# Altium schematic sheet Pulser & AD8331.SchDoc
size A3
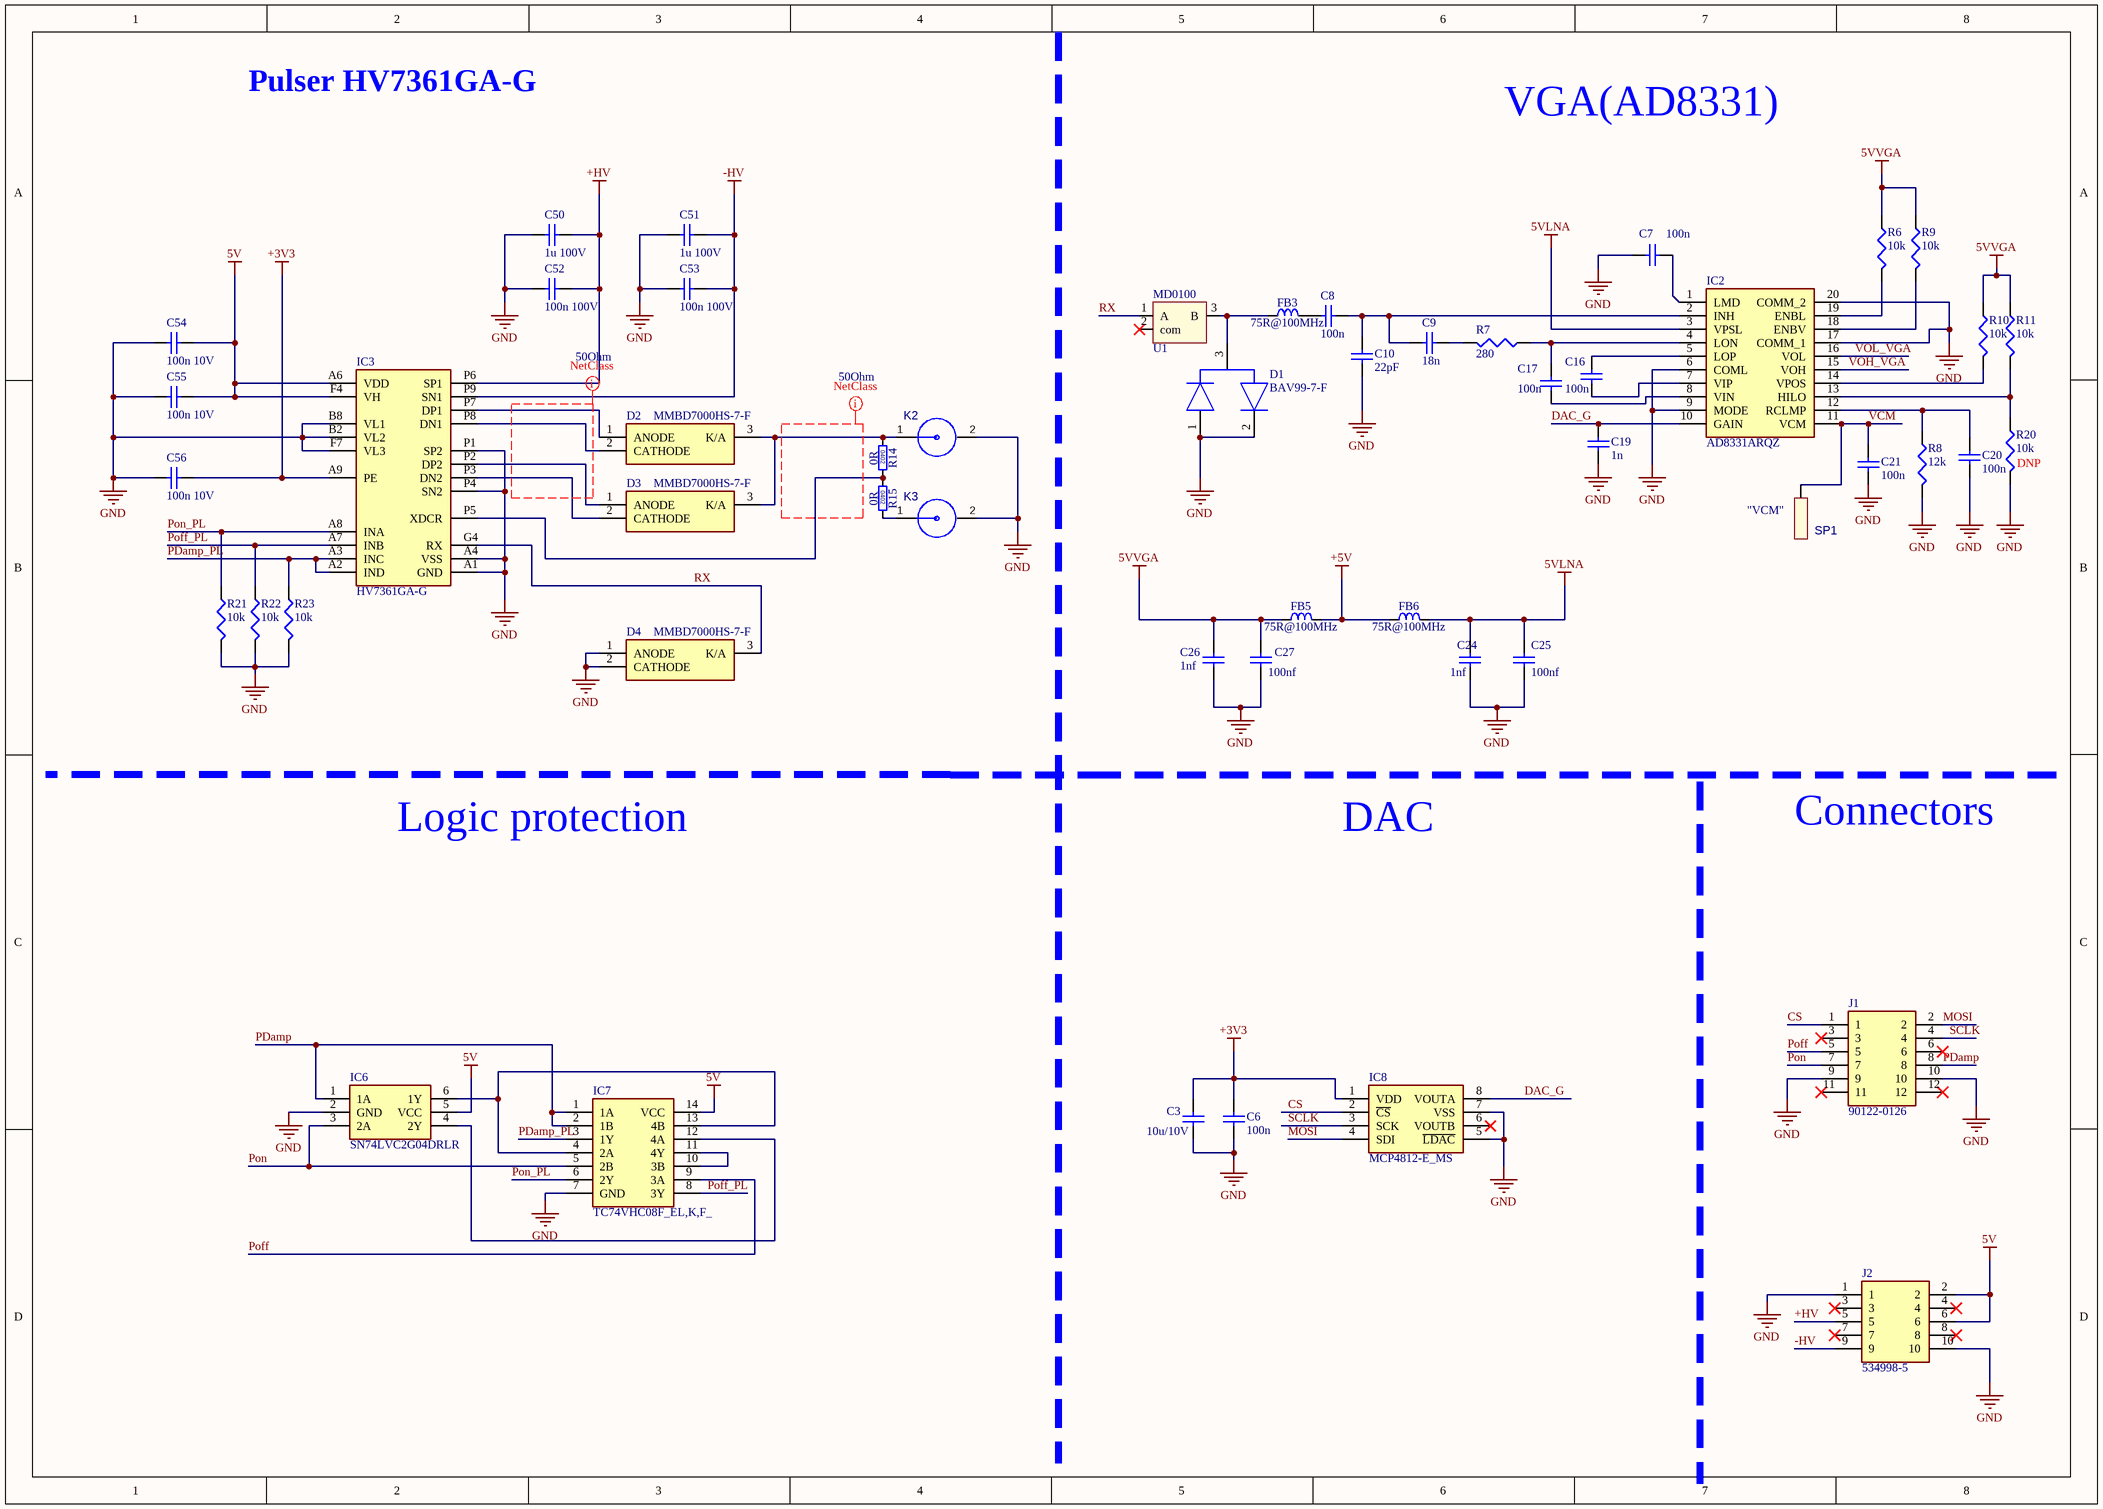
[diagram p0: Pulser & AD8331.SchDoc]

## Parts
C3  value 10u/10V  [0402_C]  (hidden comment: cap0603)
C6  value 100n  [0402_C]  (hidden comment: cap0402)
C7  value 100n  [0402_C]  (hidden comment: cap0402)
C8  value 100n  [0402_C]  (hidden comment: cap0402)
C9  value 18n  [0402_C]  (hidden comment: cap0402)
C10  value 22pF  [0402_C]  (hidden comment: cap0402)
C16  value 100n  [0402_C]  (hidden comment: cap0402)
C17  value 100n  [0402_C]  (hidden comment: cap0402)
C19  value 1n  [0402_C]  (hidden comment: cap0402)
C20  value 100n  [0402_C]  (hidden comment: cap0402)
C21  value 100n  [0402_C]  (hidden comment: cap0402)
C24  value 1nf  [0402_C]  (hidden comment: cap0402)
C25  value 100nf  [0402_C]  (hidden comment: cap0402)
C26  value 1nf  [0402_C]  (hidden comment: cap0402)
C27  value 100nf  [0402_C]  (hidden comment: cap0402)
C50  value 1u 100V  [C0805]  (hidden comment: cap0603)
C51  value 1u 100V  [C0805]  (hidden comment: cap0603)
C52  value 100n 100V  [0402_C]  (hidden comment: cap0402)
C53  value 100n 100V  [0402_C]  (hidden comment: cap0402)
C54  value 100n 10V  [0402_C]  (hidden comment: cap0402)
C55  value 100n 10V  [0402_C]  (hidden comment: cap0402)
C56  value 100n 10V  [0402_C]  (hidden comment: cap0402)
D1  BAV99-7-F  [SOT95P240X120-3N]
D2  MMBD7000HS-7-F  [SOT96P240X110-3N_]
D3  MMBD7000HS-7-F  [SOT96P240X110-3N_]
D4  MMBD7000HS-7-F  [SOT96P240X110-3N_]
FB3  75R@100MHz  [SM0603_3D_res]
FB5  75R@100MHz  [SM0603_3D_res]
FB6  75R@100MHz  [SM0603_3D_res]
IC2  AD8331ARQZ  [SOP64P600X175-20N]
IC3  HV7361GA-G  [BGA22C50P9X14_500X700X105]
IC6  SN74LVC2G04DRLR  [SOTFL50P160X60-6N]
IC7  TC74VHC08F_EL,K,F_  [SOIC127P780X190-14N_]
IC8  MCP4812-E_MS  [SOP65P490X110-8N]
J1  90122-0126  [HDRRA12W65P254_2X6_1516X250X615P]
J2  534998-5  [RHDR10W77P254X254_2X5_1270X503X635P]
K2  SMA_Edge  [AMPHENOL_132357-11]  (value not drawn)
K3  SMA_Edge  [AMPHENOL_132357-11]  (value not drawn)
R6  10k  [0402_R]
R7  280  [0402_R]
R8  12k  [0402_R]
R9  10k  [0402_R]
R10  10k  [0402_R]
R11  10k  [0402_R]
R14  0R  [0402_R]
R15  0R  [0402_R]
R20  10k  [0402_R]
R21  10k  [0402_R]
R22  10k  [0402_R]
R23  10k  [0402_R]
SP1  value "VCM"  [SolderPad_D1mm _round]  (hidden comment: SolderPad D1mm_round)
U1  T/R switch  [SOT89-150P409X160-3N]  (value not drawn)

## Nets
5V: C54.1 C55.1 IC3.A6(VDD) IC3.F4(VH) IC6.5(VCC) IC7.14(VCC) J2.2 J2.6
5VLNA: C24.2 C25.2 FB6.2 IC2.3(VPSL)
5VVGA: C26.2 C27.2 FB5.1 R6.1 R9.1 R10.1 R11.1
+3V3: C3.1 C6.1 C56.1 IC3.A9(PE) IC8.1(VDD)
+5V: FB5.2 FB6.1
+HV: C50.1 C52.2 IC3.P6(SP1) J2.5
-HV: C51.1 C53.2 IC3.P9(SN1) J2.9
GND: C3.2 C6.2 C7.1 C10.1 C19.1 C20.1 C21.2 C24.1 C25.1 C26.1 C27.1 C50.2 C51.2 C52.1 C53.1 C54.2 C55.2 C56.2 D1.1(ANODE) D1.2(CATHODE) D4.1(ANODE) D4.2(CATHODE) IC2.6(COML) IC2.9(MODE) IC2.17(COMM_1) IC2.20(COMM_2) IC3.A1(GND) IC3.A4(VSS) IC3.B2(VL2) IC3.B8(VL1) IC3.F7(VL3) IC3.P1(SP2) IC3.P4(SN2) IC6.2(GND) IC7.7(GND) IC8.5(~{LDAC}) IC8.7(VSS) J1.9 J1.10 J2.1 J2.10 K2.2 K3.2 R8.2 R20.2 R21.2 R22.2 R23.2
CS: IC8.2(~{CS}) J1.1
DAC_G: C19.2 IC2.10(GAIN) IC8.8(VOUTA)
MOSI: IC8.4(SDI) J1.2
PDamp: IC6.1(1A) IC7.1(1A) IC7.2(1B) J1.8
PDamp_PL: IC3.A2(IND) IC3.A3(INC) IC7.3(1Y) R23.1
Poff: IC7.9(3A) J1.5
Poff_PL: IC3.A7(INB) IC7.8(3Y) R22.1
Pon: IC6.3(2A) IC7.5(2B) J1.7
Pon_PL: IC3.A8(INA) IC7.6(2Y) R21.1
RX: D4.3(K/A) IC3.G4(RX) U1.1(A)
SCLK: IC8.3(SCK) J1.4
VCM: C21.1 IC2.11(VCM) SP1.1
VOH_VGA: IC2.15(VOH)
VOL_VGA: IC2.16(VOL)
NetC7_2: C7.2 IC2.1(LMD)
NetC8_1: C8.1 FB3.2
NetC8_2: C8.2 C9.2 C10.2 IC2.2(INH)
NetC9_1: C9.1 R7.2
NetC16_1: C16.1 IC2.7(VIP)
NetC16_2: C16.2 IC2.5(LOP)
NetC17_1: C17.1 IC2.8(VIN)
NetC17_2: C17.2 IC2.4(LON) R7.1
NetC20_2: C20.2 IC2.12(RCLMP) R8.1
NetD1_3: D1.3(A/K) FB3.1 U1.3(B)
NetD2_1: D2.1(ANODE) IC3.P7(DP1)
NetD2_2: D2.2(CATHODE) IC3.P8(DN1)
NetD2_3: D2.3(K/A) D3.3(K/A) K2.1 R14.1
NetD3_1: D3.1(ANODE) IC3.P2(DP2)
NetD3_2: D3.2(CATHODE) IC3.P3(DN2)
NetIC2_13: IC2.13(HILO) R11.2 R20.1
NetIC2_14: IC2.14(VPOS) R10.2
NetIC2_18: IC2.18(ENBV) R9.2
NetIC2_19: IC2.19(ENBL) R6.2
NetIC3_P5: IC3.P5(XDCR) R14.2 R15.1
NetIC6_4: IC6.4(2Y) IC7.12(4A)
NetIC6_6: IC6.6(1Y) IC7.4(2A) IC7.13(4B)
NetIC7_10: IC7.10(3B) IC7.11(4Y)
NetK3_1: K3.1 R15.2

Not connected (* = marked no-connect by the designer): IC8 6(VOUTB)*; J1 3* 6* 11* 12*; J2 3* 4* 7* 8*; U1 2(com)*

## Layout directives
net class 50Ohm: (no net found under the mark)

## Notes on the sheet
- Pulser HV7361GA-G
- VGA(AD8331)
- (near U1) MD0100
- (near R20) DNP
- Logic protection
- DAC
- Connectors
- (in symbol Res_0402_EU) 0402

## Library data of the parts
C3 C24 C26 C50 C51 = cap0603: Capacitor  0603 inch; Published: 8-Jun-2000; LatestRevisionDate: 17-Jul-2002; LatestRevisionNote: Re-released for DXP Platform.; PackageReference: RAD-0.3; Publisher: Altium Limited; PackageDescription: Radial Cap, Thru-Hole; 2 Leads; 0.3 in Pin Spacing
C6-C10 C16 C17 C19-C21 C25 C27 C52-C56 = cap0603: Capacitor  0402 inch; Published: 8-Jun-2000; LatestRevisionDate: 17-Jul-2002; LatestRevisionNote: Re-released for DXP Platform.; PackageReference: RAD-0.3; Publisher: Altium Limited; PackageDescription: Radial Cap, Thru-Hole; 2 Leads; 0.3 in Pin Spacing
D1 = BAV99-7-F: Diode; Manufacturer_Name: Diodes Inc.; Datasheet Link: https://www.diodes.com/assets/Datasheets/ds12007.pdf; Height: 1.2mm; Manufacturer_Part_Number: BAV99-7-F; Mouser Part Number: 621-BAV99-F; Mouser Price/Stock: https://www.mouser.co.uk/ProductDetail/Diodes-Incorporated/BAV99-7-F?qs=E9Ihi8A05%252BSTVRjo74hQDA%3D%3D; Arrow Part Number: BAV99-7-F; Arrow Price/Stock: https://www.arrow.com/en/products/bav99-7-f/diodes-incorporated?region=nac
D2-D4 = MMBD7000HS-7-F: Diode; Manufacturer_Name: Diodes Inc.; Datasheet Link: https://www.diodes.com/assets/Datasheets/ds31782.pdf; Height: 1.1mm; Manufacturer_Part_Number: MMBD7000HS-7-F; Mouser Part Number: 621-MMBD7000HS-7-F; Mouser Price/Stock: https://www.mouser.co.uk/ProductDetail/Diodes-Incorporated/MMBD7000HS-7-F/?qs=4YT44p7w2bs7ic313M4gfA%3D%3D; Arrow Part Number: MMBD7000HS-7-F; Arrow Price/Stock: https://www.arrow.com/en/products/mmbd7000hs-7-f/diodes-incorporated
FB3 FB5 FB6 = chip inductance 0603: Part Number: IND0805_MURATA_BLM21BB750SN1D; Part Description: SMD EMIFIL Suppression Chip Ferrite Bead; Manufacturer: MURATA; Manufacturer Part Number: BLM21BB750SN1D; Power: 700mA; Resistance: 0.16R; Tolerance: ±25%; Table: Inductors SMD; Component Kind: Standard; Component Type: Standard; Footprint: INDC2012X105N; Pin Count: 2; Value: 75R@100MHz; Status: None; Case: 0805; Mounted: Yes; Socket: No; SMD: Yes; ComponentHeight: 1.05mm; Author: S. Jafar; CreateDate: 12/21/2015; LatestRevisionDate: 12/21/2015
IC2 = AD8331ARQZ: Integrated Circuit; Manufacturer_Name: Analog Devices; Datasheet Link: http://www.analog.com/static/imported-files/data_sheets/AD8331_8332_8334.pdf; Height: 1.75mm; Manufacturer_Part_Number: AD8331ARQZ; Mouser Part Number: 584-AD8331ARQZ; Mouser Price/Stock: https://www.mouser.co.uk/ProductDetail/Analog-Devices/AD8331ARQZ?qs=%2FtpEQrCGXCwx0%2F22gf7ohQ%3D%3D; Arrow Part Number: AD8331ARQZ; Arrow Price/Stock: https://www.arrow.com/en/products/ad8331arqz/analog-devices
IC3 = HV7361GA-G: Integrated Circuit; Manufacturer_Name: Microchip; Datasheet Link: http://ww1.microchip.com/downloads/en/DeviceDoc/20005570C.pdf; Height: 1.05mm; Manufacturer_Part_Number: HV7361GA-G; Mouser Part Number: 579-HV7361GA-G; Mouser Price/Stock: https://www.mouser.co.uk/ProductDetail/Microchip-Technology/HV7361GA-G?qs=NoqMqJKvPFJ98Yl1cb744A%3D%3D; Arrow Part Number: HV7361GA-G; Arrow Price/Stock: https://www.arrow.com/en/products/hv7361ga-g/microchip-technology
IC6 = SN74LVC2G04DRLR: Integrated Circuit; Manufacturer_Name: Texas Instruments; Datasheet Link: http://www.ti.com/lit/gpn/sn74lvc2g04; Height: 0.6mm; Manufacturer_Part_Number: SN74LVC2G04DRLR; Mouser Part Number: 595-SN74LVC2G04DRLR; Mouser Price/Stock: https://www.mouser.co.uk/ProductDetail/Texas-Instruments/SN74LVC2G04DRLR?qs=pajgIaoyDUgGT9cUBVgEUw%3D%3D; Arrow Part Number: SN74LVC2G04DRLR; Arrow Price/Stock: https://www.arrow.com/en/products/sn74lvc2g04drlr/texas-instruments?region=nac
IC7 = TC74VHC08F_EL,K,F_: Hardware; Manufacturer_Name: Toshiba; Manufacturer_Part_Number: TC74VHC08F(EL,K,F); Datasheet Link: https://componentsearchengine.com/Datasheets/1/TC74VHC08F(EL,K,F).pdf; Height: 1.9mm; Mouser Part Number: 757-TC74VHC08FELKF; Mouser Price/Stock: https://www.mouser.co.uk/ProductDetail/Toshiba/TC74VHC08FELKF?qs=f0GatGUIxV0KIqTggGqR%252BQ%3D%3D
IC8 = MCP4812-E_MS: Integrated Circuit; Manufacturer_Name: Microchip; Manufacturer_Part_Number: MCP4812-E/MS; Datasheet Link: http://ww1.microchip.com/downloads/en/DeviceDoc/20002249B.pdf; Height: 1.1mm; Mouser Part Number: 579-MCP4812-E/MS; Mouser Price/Stock: https://www.mouser.co.uk/ProductDetail/Microchip-Technology/MCP4812-E-MS?qs=bxUt0k7cytJEpyWPtzKy6A%3D%3D; Arrow Part Number: MCP4812-E/MS; Arrow Price/Stock: https://www.arrow.com/en/products/mcp4812-ems/microchip-technology
J1 = 90122-0126: Connector; Manufacturer_Name: Molex; Datasheet Link: https://componentsearchengine.com/Datasheets/2/90122-0126.pdf; Height: 6.15mm; Manufacturer_Part_Number: 90122-0126; Mouser Part Number: 538-90122-0126; Mouser Price/Stock: https://www.mouser.co.uk/ProductDetail/Molex/90122-0126?qs=PvP5v7Eimsm0iCqn6boA0w%3D%3D
J2 = 534998-5: Connector; Manufacturer_Name: TE Connectivity; Datasheet Link: http://uk.rs-online.com/web/p/products/8638265; Height: 6.35mm; Manufacturer_Part_Number: 534998-5; Mouser Part Number: 571-5349985; Mouser Price/Stock: https://www.mouser.co.uk/ProductDetail/TE-Connectivity/534998-5?qs=X1mjqRbeMc7kAKePtTQuSw%3D%3D; Arrow Part Number: 534998-5; Arrow Price/Stock: https://www.arrow.com/en/products/534998-5/te-connectivity?region=nac
R6 R9-R11 R20-R23 = RC0402FR-0710KL: RES 10K OHM 1/16W 1% 0402 SMD; Resistance (Ohms): 280; Power (Watts): 0.063W, 1/16W; .Checked PCB: used; Category: Resistors; Package / Case: 0402 (1005 Metric); Value: 10k; .Checked SCH: used; Size / Dimension: 0.039" L x 0.020" W (1.00mm x 0.50mm); Height: 0.016" (0.40mm); ComponentLink1URL: http://www.yageo.com/documents/recent/PYu-RC0402_51_RoHS_L_6.pdf; ComponentLink1Description: http://www.yageo.com/documents/recent/PYu-RC0402_51_RoHS_L_6.pdf
R7 = RC0402FR-0710KL: RES 280 OHM 1/16W 0402 SMD; Power (Watts): 0.063W, 1/16W; .Checked PCB: used; Category: Resistors; Package / Case: 0402 (1005 Metric); Resistance (Ohms): 280; Value: 280; .Checked SCH: used; Size / Dimension: 0.039" L x 0.020" W (1.00mm x 0.50mm); Height: 0.016" (0.40mm); ComponentLink1URL: http://www.yageo.com/documents/recent/PYu-RC0402_51_RoHS_L_6.pdf; ComponentLink1Description: http://www.yageo.com/documents/recent/PYu-RC0402_51_RoHS_L_6.pdf
R8 = RC0402FR-0710KL: RES 12K OHM 1/16W 0402 SMD; Power (Watts): 0.063W, 1/16W; .Checked PCB: used; Category: Resistors; Package / Case: 0402 (1005 Metric); Value: 12k; .Checked SCH: used; Size / Dimension: 0.039" L x 0.020" W (1.00mm x 0.50mm); Height: 0.016" (0.40mm); ComponentLink1URL: http://www.yageo.com/documents/recent/PYu-RC0402_51_RoHS_L_6.pdf; ComponentLink1Description: http://www.yageo.com/documents/recent/PYu-RC0402_51_RoHS_L_6.pdf
R14 R15 = Res_0402_EU: Part Number: R1206_4K7_1%_0.25W_100PPM; Part Description: General Purpose Thick Film Chip Resistor; Manufacturer: GENERIC; Manufacturer1 Part Number: NRC12F4701TRF; Value: 4k7; Power: 0.25W; TC: ±100ppm/°C; Tolerance: ±1%; Table: Resistors SMD; Component Kind: Standard; Component Type: Standard; Footprint: RESC3216X65N; Pin Count: 2; Status: Preferred; Manufacturer Part Number: R1206_4K7_1%_0.25W_100PPM; Case: 1206; Mounted: Yes; Socket: No; SMD: Yes; Manufacturer1 Example: NIC COMPONENT; Manufacturer1 ComponentHeight: 0.65mm; HelpURL: \\cern.ch\dfs\Applications\Altium\Datasheets\R1206_NIC_NRC.pdf; Author: CERN DEM JLC; CreateDate: 12/3/2007; LatestRevisionDate: 3/13/2008
SP1 = SolderPad D1mm_round: for finger touch
U1 = MD0100N8-G
K2 K3 = SMA_Edge: Value: *